# EAGLE design mainboard (EAGLE 7.6.0)
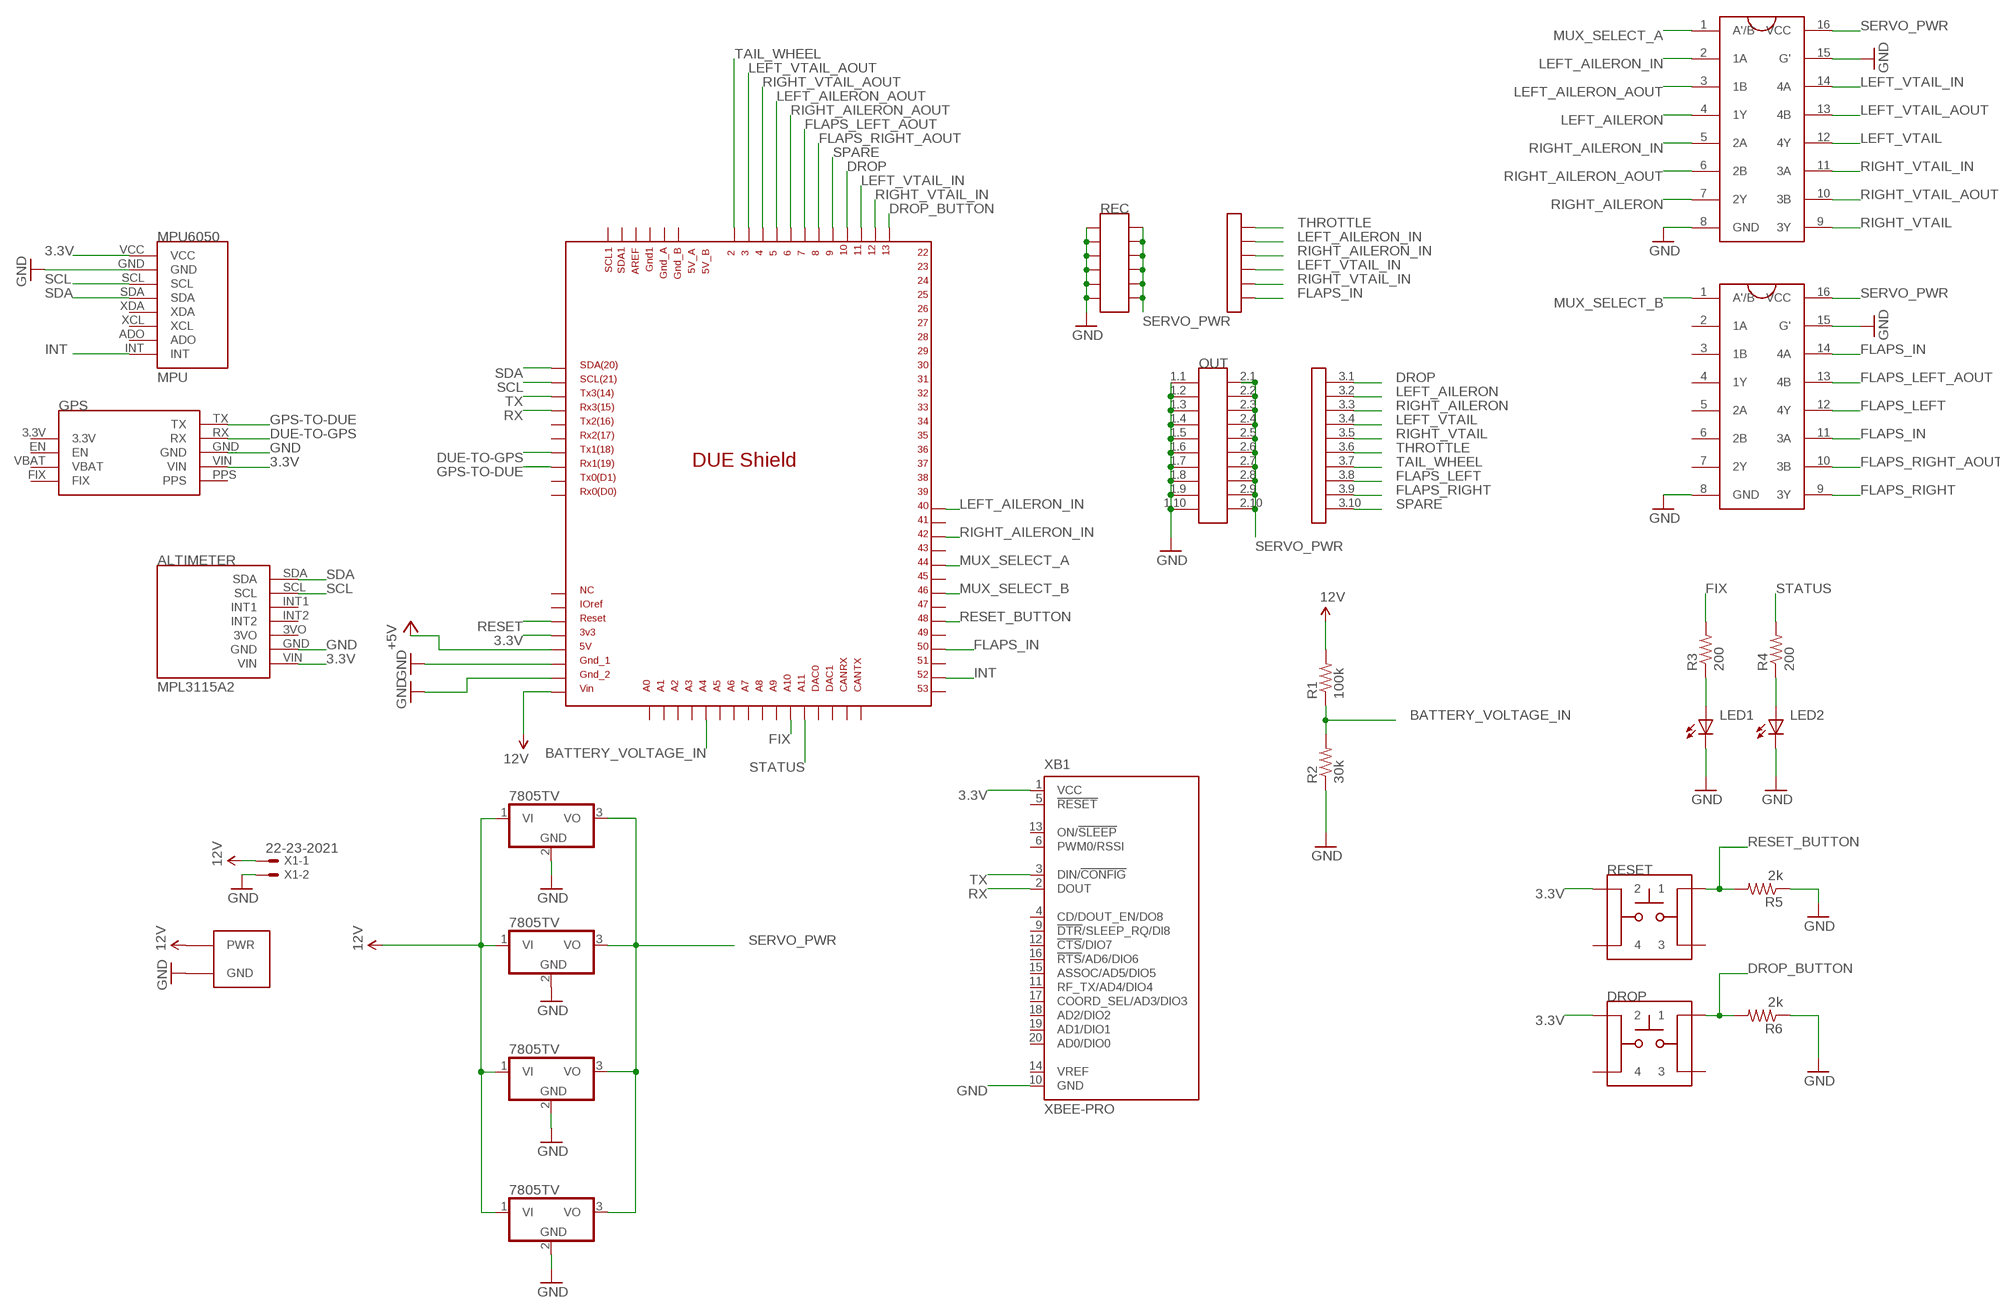
[diagram p0: schematic, sheet 1]

## Parts
DROP  PUSHBUTTON  [PUSHBUTTON]
G1  GPS_ADAFRUIT  [GPS_ADAFRUIT]
IC1  7805TV  [TO220V]
IC2  7805TV  [TO220V]
IC3  7805TV  [TO220V]
IC4  7805TV  [TO220V]
LED1  LED5MM  [LED5MM]
LED2  LED5MM  [LED5MM]
MPU  MPU6050  [MPU6050]
MUX1  SN74HC157  [SN74HC157]
MUX2  SN74HC157  [SN74HC157]
OUT  PIN_3X10  [PIN_3X10]
R1  100k  R-US_0204/7  [0204/7]
R2  30k  R-US_0204/7  [0204/7]
R3  200  R-US_0204/7  [0204/7]
R4  200  R-US_0204/7  [0204/7]
R5  2k  R-US_0204/7  [0204/7]
R6  2k  R-US_0204/7  [0204/7]
REC  PIN_3X6  [PIN_3X6]
RESET  PUSHBUTTON  [PUSHBUTTON]
U$1  DUE(NORMAL)  [DUE(NORMAL)]
U$3  PWR-BATT  [PWR-BATT]
U$4  ALTIMETER_V5  [ALTIMETER_V5]
X1  22-23-2021  [22-23-2021]
XB1  XBEE-PRO  [XBEE-PRO]

## Nets
3.3V: DROP.2 G1.VIN MPU.VCC RESET.2 U$1.3V3 U$4.VIN XB1.1(VCC)
12V: IC1.1(VI) IC2.1(VI) IC3.1(VI) IC4.1(VI) R1.2 U$1.VIN U$3.PWR X1.1
+5V: U$1.5V
BATTERY_VOLTAGE_IN: R1.1 R2.2 U$1.A4
DROP: OUT.3.1 U$1.10
DROP_BUTTON: DROP.1 R6.2 U$1.13
DUE-TO-GPS: G1.RX U$1.TX1
FIX: R3.2 U$1.A10
FLAPS_IN: MUX2.11(3A) MUX2.14(4A) REC.3.6 U$1.50
FLAPS_LEFT: MUX2.12(4Y) OUT.3.8
FLAPS_LEFT_AOUT: MUX2.13(4B) U$1.7
FLAPS_RIGHT: MUX2.9(3Y) OUT.3.9
FLAPS_RIGHT_AOUT: MUX2.10(3B) U$1.8
GND: G1.GND IC1.2(GND) IC2.2(GND) IC3.2(GND) IC4.2(GND) LED1.K(C) LED2.K(C) MPU.GND MUX1.8(GND) MUX1.15(G') MUX2.8(GND) MUX2.15(G') OUT.1.1 OUT.1.2 OUT.1.3 OUT.1.4 OUT.1.5 OUT.1.6 OUT.1.7 OUT.1.8 OUT.1.9 OUT.1.10 R2.1 R5.1 R6.1 REC.1.1 REC.1.2 REC.1.3 REC.1.4 REC.1.5 REC.1.6 U$1.GND_1 U$1.GND_2 U$3.GND U$4.GND X1.2 XB1.10(GND)
GPS-TO-DUE: G1.TX U$1.RX1
INT: MPU.INT U$1.52
LEFT_AILERON: MUX1.4(1Y) OUT.3.2
LEFT_AILERON_AOUT: MUX1.3(1B) U$1.5
LEFT_AILERON_IN: MUX1.2(1A) REC.3.2 U$1.40
LEFT_VTAIL: MUX1.12(4Y) OUT.3.4
LEFT_VTAIL_AOUT: MUX1.13(4B) U$1.3
LEFT_VTAIL_IN: MUX1.14(4A) REC.3.4 U$1.11
MUX_SELECT_A: MUX1.1(A'/B) U$1.44
MUX_SELECT_B: MUX2.1(A'/B) U$1.46
N$1: LED1.A R3.1
N$3: LED2.A R4.1
RESET: U$1.RESET
RESET_BUTTON: R5.2 RESET.1 U$1.48
RIGHT_AILERON: MUX1.7(2Y) OUT.3.3
RIGHT_AILERON_AOUT: MUX1.6(2B) U$1.6
RIGHT_AILERON_IN: MUX1.5(2A) REC.3.3 U$1.42
RIGHT_VTAIL: MUX1.9(3Y) OUT.3.5
RIGHT_VTAIL_AOUT: MUX1.10(3B) U$1.4
RIGHT_VTAIL_IN: MUX1.11(3A) REC.3.5 U$1.12
RX: U$1.RX3 XB1.2(DOUT)
SCL: MPU.SCL U$1.SCL U$4.SCL
SDA: MPU.SDA U$1.SDA U$4.SDA
SERVO_PWR: IC1.3(VO) IC2.3(VO) IC3.3(VO) IC4.3(VO) MUX1.16(VCC) MUX2.16(VCC) OUT.2.1 OUT.2.2 OUT.2.3 OUT.2.4 OUT.2.5 OUT.2.6 OUT.2.7 OUT.2.8 OUT.2.9 OUT.2.10 REC.2.1 REC.2.2 REC.2.3 REC.2.4 REC.2.5 REC.2.6
SPARE: OUT.3.10 U$1.9
STATUS: R4.2 U$1.A11
TAIL_WHEEL: OUT.3.7 U$1.2
THROTTLE: OUT.3.6 REC.3.1
TX: U$1.TX3 XB1.3(DIN/!CONFIG)
Unconnected: DROP.3 DROP.4 G1.3.3V G1.EN G1.FIX G1.PPS G1.VBAT MPU.ADO MPU.XCL MPU.XDA MUX2.2(1A) MUX2.3(1B) MUX2.4(1Y) MUX2.5(2A) MUX2.6(2B) MUX2.7(2Y) RESET.3 RESET.4 U$1.41 U$1.43 U$1.45 U$1.47 U$1.49 U$1.51 U$1.53 U$1.A0 U$1.A1 U$1.A2 U$1.A3 U$1.A5 U$1.A6 U$1.A7 U$1.A8 U$1.A9 U$1.AREF U$1.CANRX U$1.CANTX U$1.DAC0 U$1.DAC1 U$1.GND1 U$1.GND_A U$1.GND_B U$1.IOREF U$1.NC U$1.RX0 U$1.RX2 U$1.SCL1 U$1.SDA1 U$1.TX0 U$1.TX2 U$4.3VO U$4.INT1 U$4.INT2 XB1.4(CD/DOUT_EN/DO8) XB1.5(!RESET) XB1.6(PWM0/RSSI) XB1.9(!DTR!/SLEEP_RQ/DI8) XB1.11(RF_TX/AD4/DIO4) XB1.12(!CTS!/DIO7) XB1.13(ON/!SLEEP) XB1.14(VREF) XB1.15(ASSOC/AD5/DIO5) XB1.16(!RTS!/AD6/DIO6) XB1.17(COORD_SEL/AD3/DIO3) XB1.18(AD2/DIO2) XB1.19(AD1/DIO1) XB1.20(AD0/DIO0)

## Library data of the parts
DROP RESET = QADT:PUSHBUTTON: E-SWITCH KS0-01Q-01
G1 = QADT:GPS_ADAFRUIT: Adafruit GPS Footprint for Adafruit Ultimate GPS breakout board
IC1-IC4 = linear:78*: Positive VOLTAGE REGULATOR Source: http://cache.national.com/ds/LM/LM78L05.pdf http://www.fairchildsemi.com/ds/LM/LM7805.pdf
LED1 LED2 = led:LED: LED OSRAM: - CHIPLED LG R971, LG N971, LY N971, LG Q971, LY Q971, LO R971, LY R971 LH N974, LH R974 LS Q976, LO Q976, LY Q976 LO Q996 - Hyper CHIPLED LW Q18S LB Q993, LB Q99A, LB R99A - SideLED LS A670, LO A670, LY A670, LG A670, LP A670 LB A673, LV A673, LT A673, LW A673 LH A674 LY A675 LS A676, LA A676, LO A676, LY A676, LW A676 LS A679, LY A679, LG A679 - Hyper Micro SIDELED® LS Y876, LA Y876, LO Y876, LY Y876 LT Y87S - SmartLED LW L88C, LW L88S LB L89C, LB L89S, LG L890 LS L89K, LO L89K, LY L89K LS L896, LA L896, LO L896, LY L896 - TOPLED LS T670, LO T670, LY T670, LG T670, LP T670 LSG T670, LSP T670, LSY T670, LOP T670, LYG T670 LG T671, LOG T671, LSG T671 LB T673, LV T673, LT T673, LW T673 LH T674 LS T676, LA T676, LO T676, LY T676, LB T676, LH T676, LSB T676, LW T676 LB T67C, LV T67C, LT T67C, LS T67K, LO T67K, LY T67K, LW E67C LS E67B, LA E67B, LO E67B, LY E67B, LB E67C, LV E67C, LT E67C LW T67C LS T679, LY T679, LG T679 LS T770, LO T770, LY T770, LG T770, LP T770 LB T773, LV T773, LT T773, LW T773 LH T774 LS E675, LA E675, LY E675, LS T675 LS T776, LA T776, LO T776, LY T776, LB T776 LHGB T686 LT T68C, LB T68C - Hyper Mini TOPLED® LB M676 - Mini TOPLED Santana® LG M470 LS M47K, LO M47K, LY M47K Source: http://www.osram.convergy.de LUXEON: - LUMILED® LXK2-PW12-R00, LXK2-PW12-S00, LXK2-PW14-U00, LXK2-PW14-V00 LXK2-PM12-R00, LXK2-PM12-S00, LXK2-PM14-U00 LXK2-PE12-Q00, LXK2-PE12-R00, LXK2-PE12-S00, LXK2-PE14-T00, LXK2-PE14-U00 LXK2-PB12-K00, LXK2-PB12-L00, LXK2-PB12-M00, LXK2-PB14-N00, LXK2-PB14-P00, LXK2-PB14-Q00 LXK2-PR12-L00, LXK2-PR12-M00, LXK2-PR14-Q00, LXK2-PR14-R00 LXK2-PD12-Q00, LXK2-PD12-R00, LXK2-PD12-S00 LXK2-PH12-R00, LXK2-PH12-S00 LXK2-PL12-P00, LXK2-PL12-Q00, LXK2-PL12-R00 Source: www.luxeon.com KINGBRIGHT: KA-3528ASYC Source: www.kingbright.com
MPU = aero_sensors:MPU6050
MUX1 MUX2 = QADT:SN74HC157: 2-to-1 MUX TI SN74HC157
OUT = QADT:PIN_3X10
R1-R6 = rcl:R-US_: RESISTOR, American symbol
REC = DUElib130425:PIN_3X6
U$1 = DUElib130425:DUE(NORMAL)
U$3 = DUElib130425:PWR-BATT
U$4 = QADT:ALTIMETER_V5: Adafruit Altimeter MPL3115A2
X1 = con-molex:22-23-2021: .100" (2.54mm) Center Header - 2 Pin; MF: MOLEX; MPN: 22-23-2021; OC_FARNELL: 1462926; OC_NEWARK: 25C3832
XB1 = maxstream:XBEE: XBee (TM) /XBee-PRO(TM) OEM RF Modules Source: MaxStream, Inc. xbee_productmanual.pdf; MPN: XBP24-AWI-001; OC_FARNELL: 1337916; OC_NEWARK: 42M2667

## Board
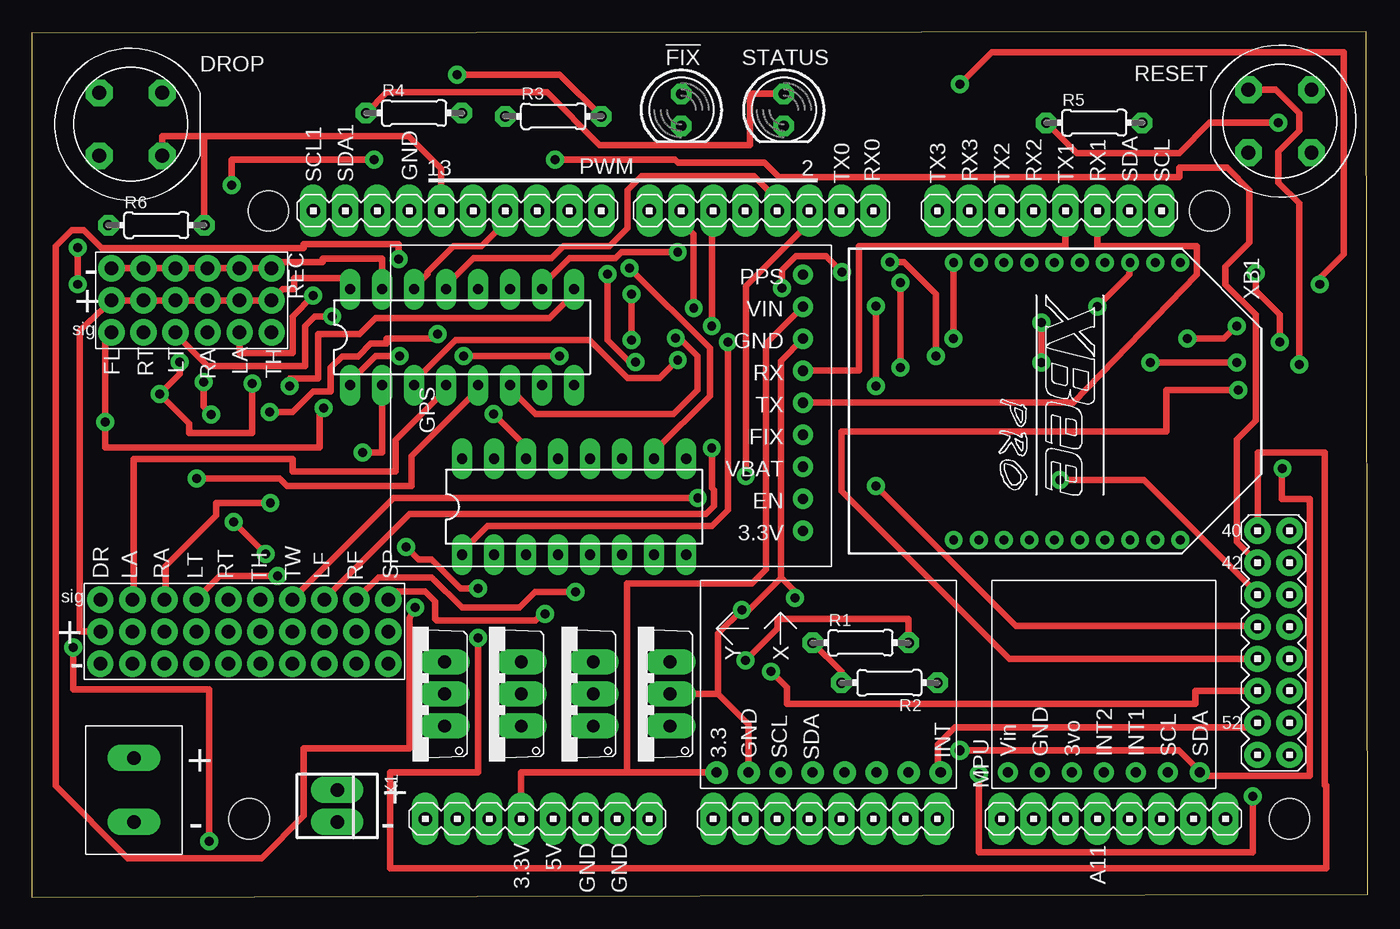
[diagram p1: board, top side]
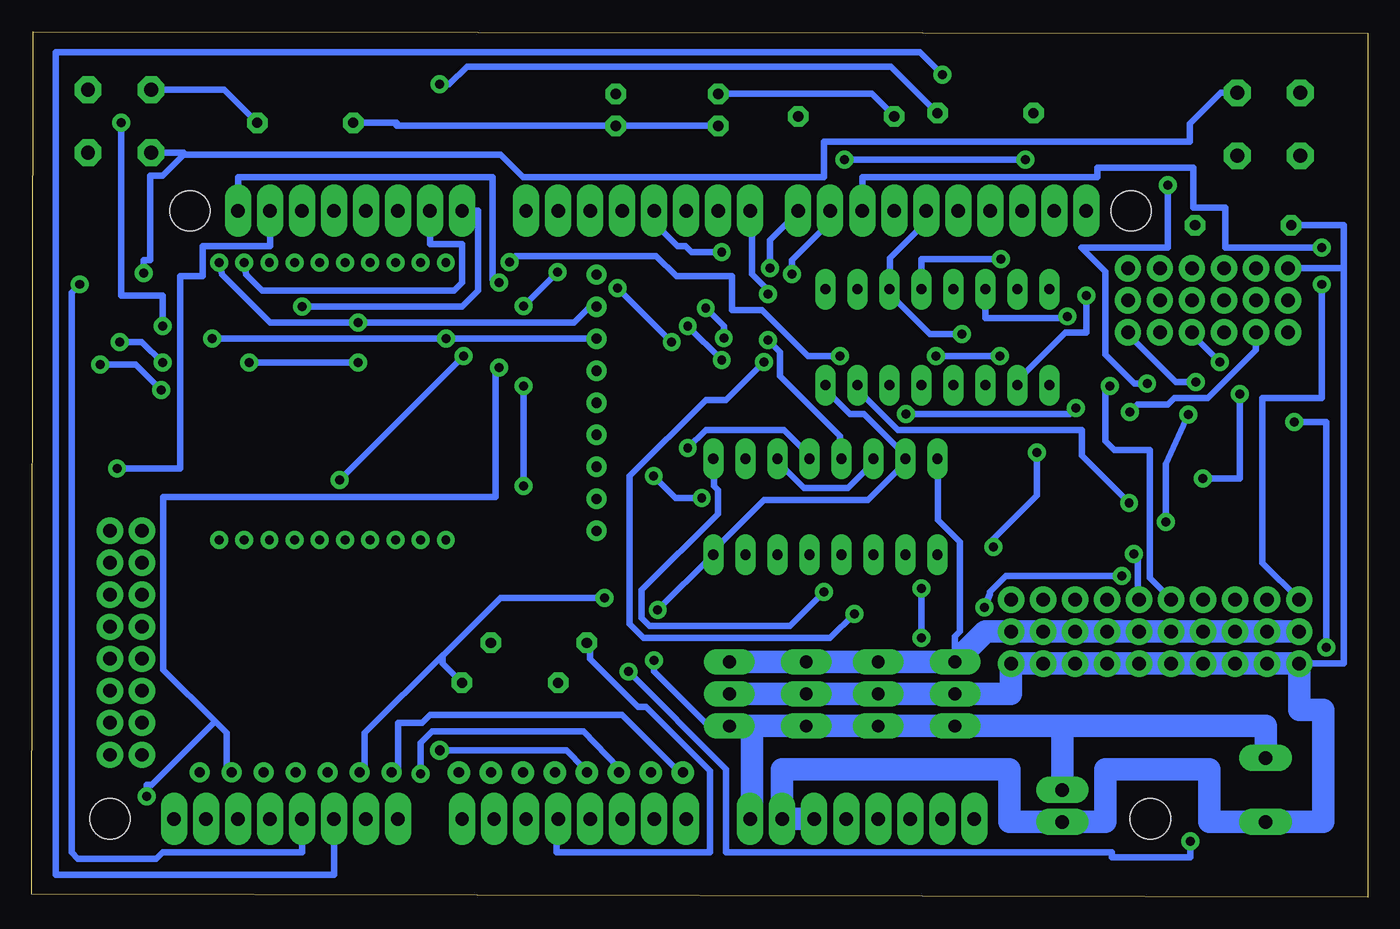
[diagram p2: board, bottom side, seen from below]

Size 106.05 x 68.71 mm. Coordinates in mm from the lower left corner, seen from the top.
Outline: 0,0 106.05,0.25 105.92,68.71 0,68.58 0,0
Copper layers (1*16): Top 0.035mm / dielectric 1.5mm / Bottom 0.035mm
Design rules "default *": minimum track width 20mil, minimum drill 28mil, track to track 16mil, track to pad 12mil, pad to pad 12mil, via to via 12mil, smd to smd 8mil, copper to edge 40mil, drill to drill 8mil, minimum pad ring 10mil, minimum via ring 8mil, stop-mask expansion 4mil, vias tented up to drill 0mil, thermal gap 10mil
Holes 3.2 mm at 18.8,54.48 99.82,6.22 93.47,54.48 17.27,6.22

### Footprints (pad centres in the part's own frame; a part is rotated, then mirrored left to right if it is on the bottom)
PUSHBUTTON = drill 1.1 octagon: 1 2.5,2.5; 2 -2.5,2.5; 3 2.5,-2.5; 4 -2.5,-2.5
GPS_ADAFRUIT = drill 0.8: 3.3V -15.24,10.16; EN -15.24,7.62; FIX -15.24,2.54; GND -15.24,-5.08; PPS -15.24,-10.16; RX -15.24,-2.54; TX -15.24,0; VBAT -15.24,5.08; VIN -15.24,-7.62
TO220V = drill 1.016 long: 1 -2.54,-2.54; 2 0,-2.54; 3 2.54,-2.54
LED5MM = drill 0.813 octagon: A -1.27,0; K 1.27,0
MPU6050 = drill 0.8 pad 1.778: ADO -13.97,-3.81; GND -13.97,8.89; INT -13.97,-6.35; SCL -13.97,6.35; SDA -13.97,3.81; VCC -13.97,11.43; XCL -13.97,-1.27; XDA -13.97,1.27
SN74HC157 = drill 0.813 long: 1 -8.89,-3.81; 2 -6.35,-3.81; 3 -3.81,-3.81; 4 -1.27,-3.81; 5 1.27,-3.81; 6 3.81,-3.81; 7 6.35,-3.81; 8 8.89,-3.81; 9 8.89,3.81; 10 6.35,3.81; 11 3.81,3.81; 12 1.27,3.81; 13 -1.27,3.81; 14 -3.81,3.81; 15 -6.35,3.81; 16 -8.89,3.81
PIN_3X10 = drill 1.067: 1.1 0,7.62; 1.2 0,5.08; 1.3 0,2.54; 1.4 0,0; 1.5 0,-2.54; 1.6 0,-5.08; 1.7 0,-7.62; 1.8 0,-10.16; 1.9 0,-12.7; 1.10 0,-15.24; 2.1 2.54,7.62; 2.2 2.54,5.08; 2.3 2.54,2.54; 2.4 2.54,0; 2.5 2.54,-2.54; 2.6 2.54,-5.08; 2.7 2.54,-7.62; 2.8 2.54,-10.16; 2.9 2.54,-12.7; 2.10 2.54,-15.24; 3.1 5.08,7.62; 3.2 5.08,5.08; 3.3 5.08,2.54; 3.4 5.08,0; 3.5 5.08,-2.54; 3.6 5.08,-5.08; 3.7 5.08,-7.62; 3.8 5.08,-10.16; 3.9 5.08,-12.7; 3.10 5.08,-15.24
0204/7 = drill 0.813 octagon: 1 -3.81,0; 2 3.81,0
PIN_3X6 = drill 1.067: 1.1 0,5.08; 1.2 0,2.54; 1.3 0,0; 1.4 0,-2.54; 1.5 0,-5.08; 1.6 0,-7.62; 2.1 2.54,5.08; 2.2 2.54,2.54; 2.3 2.54,0; 2.4 2.54,-2.54; 2.5 2.54,-5.08; 2.6 2.54,-7.62; 3.1 5.08,5.08; 3.2 5.08,2.54; 3.3 5.08,0; 3.4 5.08,-2.54; 3.5 5.08,-5.08; 3.6 5.08,-7.62
DUE(NORMAL) = drill 1.067 long: 2 -16.51,30.48; 3 -19.05,30.48; 3V3 -39.37,-17.78; 4 -21.59,30.48; 5 -24.13,30.48; 5V -36.83,-17.78; 6 -26.67,30.48; 7 -29.21,30.48; 8 -33.02,30.48; 9 -35.56,30.48; 10 -38.1,30.48; 11 -40.64,30.48; 12 -43.18,30.48; 13 -45.72,30.48; A0 -24.13,-17.78; A1 -21.59,-17.78; A2 -19.05,-17.78; A3 -16.51,-17.78; A4 -13.97,-17.78; A5 -11.43,-17.78; A6 -8.89,-17.78; A7 -6.35,-17.78; A8 -1.27,-17.78; A9 1.27,-17.78; A10 3.81,-17.78; A11 6.35,-17.78; AREF -50.8,30.48; CANRX 13.97,-17.78; CANTX 16.51,-17.78; DAC0 8.89,-17.78; DAC1 11.43,-17.78; GND1 -48.26,30.48; GND_1 -34.29,-17.78; GND_2 -31.75,-17.78; IOREF -44.45,-17.78; NC -46.99,-17.78; RESET -41.91,-17.78; RX0 -11.43,30.48; RX1 6.35,30.48; RX2 1.27,30.48; RX3 -3.81,30.48; SCL 11.43,30.48; SCL1 -55.88,30.48; SDA 8.89,30.48; SDA1 -53.34,30.48; TX0 -13.97,30.48; TX1 3.81,30.48; TX2 -1.27,30.48; TX3 -6.35,30.48; VIN -29.21,-17.78 | drill 1.067: 40 19.05,5.08; 41 21.59,5.08; 42 19.05,2.54; 43 21.59,2.54; 44 19.05,0; 45 21.59,0; 46 19.05,-2.54; 47 21.59,-2.54; 48 19.05,-5.08; 49 21.59,-5.08; 50 19.05,-7.62; 51 21.59,-7.62; 52 19.05,-10.16; 53 21.59,-10.16; GND_A 19.05,-12.7; GND_B 21.59,-12.7
PWR-BATT = drill 1.067 long: GND 0,0; PWR 0,5.08
ALTIMETER_V5 = drill 0.8: 3VO 0,-5.08; GND 0,-7.62; INT1 0,0; INT2 0,-2.54; SCL 0,2.54; SDA 0,5.08; VIN 0,-10.16
22-23-2021 = drill 1.067 long: 1 -1.27,0; 2 1.27,0
XBEE-PRO = drill 0.711: 1 -11,9; 2 -11,7; 3 -11,5; 4 -11,3; 5 -11,1; 6 -11,-1; 7 -11,-3; 8 -11,-5; 9 -11,-7; 10 -11,-9; 11 11,-9; 12 11,-7; 13 11,-5; 14 11,-3; 15 11,-1; 16 11,1; 17 11,3; 18 11,5; 19 11,7; 20 11,9

### Placement (x,y rotation side)
DROP  7.87,61.34 270 top
G1  45.97,39.24 180 top
IC1  30.23,16.13 90 top
IC2  36.32,16.13 90 top
IC3  42.04,16.13 90 top
IC4  48.13,16.13 90 top
LED1  51.56,62.48 270 top
LED2  59.69,62.48 270 top
MPU  65.79,23.88 90 top
MUX1  34.16,44.45 0 top
MUX2  43.05,30.99 0 top
OUT  13.08,18.54 90 top
R1  65.79,20.19 0 top
R2  68.07,17.02 180 top
R3  41.4,61.98 0 top
R4  30.35,62.23 0 top
R5  84.33,61.47 0 top
R6  9.91,53.34 0 top
REC  13.97,49.91 270 top
RESET  99.06,61.6 90 top
U$1  78.23,24 0 top
U$3  8.13,5.97 0 top
U$4  87.63,9.91 270 top
X1  24.26,7.24 270 top
XB1  82.17,39.37 270 top

### Tracks (layer width: path | path; a pad name or v marks a point on that pad's centre or on a via)
3.3V  (via drill 0.71)
  Top 0.508: MPU.VCC 47.24,9.91 | 47.24,9.91 47.24,24.89 57.15,24.89 58.29,26.04 58.29,43.94 G1.VIN | U$1.3V3 38.86,9.91 47.24,9.91 | v97.16,49.53 97.16,48.13 99.06,46.23 v99.06,44.07 | v95.63,42.42 v88.77,42.42 | v80.14,42.42 v80.14,45.59
  Bottom 0.508: XB1.1 90.93,49.4 87.12,45.59 v80.14,45.59 62.99,45.59 61.72,46.86 G1.VIN | U$4.VIN 76.96,10.03 76.96,13.84 75.06,13.84 74.42,14.48 59.18,14.48 54.74,10.03 MPU.VCC | RESET.2 93.98,59.1 93.98,58.93 | DROP.2 11.68,63.84 14.14,61.38 14.14,59.94 43.18,59.94 43.18,57.15 67.06,57.15 68.83,58.93 93.98,58.93 | v99.06,44.07 97.28,44.07 v95.63,42.42 | v88.77,42.42 v80.14,42.42 | v97.16,49.53 97.16,50.55 96.65,50.55 96.65,57.28 95.63,57.28 93.98,58.93
12V  (via drill 0.71)
  Top 0.508: R1.2 69.6,22.1 59.18,22.1 59.18,21.34 v56.64,18.8
  Bottom 0.508: IC4.1 52.32,13.59 56.64,17.91 v56.64,18.8
  Bottom 1.778: 24.26,13.59 IC1.1 IC2.1 IC3.1 48.9,13.59 | 8.13,10.92 U$3.PWR 8.13,13.59 24.26,13.59 | X1.1 24.26,13.59 | 48.9,13.59 IC4.1 | U$1.VIN 48.9,6.22 48.9,13.59
BATTERY_VOLTAGE_IN
  Top 0.508: R2.2 64.26,17.91 R1.1
  Bottom 0.508: R1.1 61.72,20.19 61.72,18.92 57.91,15.11 57.28,15.11 52.2,10.03 52.2,3.56 64.39,3.56 64.39,6.22 U$1.A4
DROP  (via drill 0.71)
  Top 0.508: v3.68,51.56 v3.68,48.64
  Bottom 0.508: v3.68,51.56 11.3,51.56 11.3,54.74 13.84,54.74 13.84,57.91 21.46,57.91 21.46,57.15 40.13,57.15 U$1.10 | v3.68,48.64 3.68,39.62 8.38,39.62 8.38,26.54 OUT.3.1
DROP_BUTTON
  Top 0.508: 13.72,60.41 29.93,60.41 32.51,57.83 U$1.13 | R6.2 13.72,60.41 | 13.72,60.41 10.37,60.41 DROP.1
DUE-TO-GPS
  Top 0.508: G1.RX 65.66,41.78 65.66,51.69 82.04,51.69 U$1.TX1
FIX  (via drill 0.71)
  Top 0.508: v33.78,65.28 41.91,65.28 R3.2
  Bottom 0.508: U$1.A10 82.04,1.78 104.14,1.78 104.14,67.06 35.56,67.06 v33.78,65.28
FLAPS_IN  (via drill 0.71)
  Top 0.508: v58.67,17.91 59.94,16.64 59.94,15.37 92.33,15.37 92.33,16.38 U$1.50 | v14.1,4.44 14.1,16.51 3.3,16.51 v3.3,19.81 | REC.3.6 5.84,44.83 v5.84,37.72 5.84,35.69 22.86,35.69 22.86,38.51 v23.18,38.83 | v36.67,38.35 39.21,35.81 39.21,34.86 MUX2.14
  Bottom 0.508: v58.67,17.91 50.93,10.16 50.93,3.56 20.32,3.56 20.32,3.17 14.1,3.17 v14.1,4.44 | v3.3,19.81 3.3,37.72 v5.84,37.72 | MUX2.14 39.37,34.7 39.37,34.39 41.27,32.48 44.77,32.48 46.99,34.7 MUX2.11 | v36.67,38.35 23.65,38.35 v23.18,38.83
FLAPS_LEFT  (via drill 0.71)
  Top 0.508: v53.98,35.66 53.98,32.48 54.13,32.32 54.13,31.05 53.5,30.42 30,30.42 23.34,23.75 OUT.3.8
  Bottom 0.508: v53.98,35.66 52.55,37.08 46.35,37.08 44.45,35.18 44.45,34.86 MUX2.12
FLAPS_LEFT_AOUT  (via drill 0.71)
  Top 0.508: v47.62,47.88 v47.62,44.23
  Bottom 0.508: v47.62,44.23 46.67,43.28 46.67,41.37 41.91,36.61 41.91,34.86 MUX2.13 | v47.62,47.88 47.62,48.2 48.9,49.47 48.9,54.39 U$1.7
FLAPS_RIGHT  (via drill 0.71)
  Top 0.508: OUT.3.9 25.88,23.75 27.53,25.4 31.75,25.4 34.16,22.99 38.73,22.99 39.97,24.22 v43.18,24.22
  Bottom 0.508: v43.18,24.22 45.88,21.53 56.99,21.53 57.63,22.16 57.63,24.38 51.59,30.42 51.59,32.32 51.91,32.64 51.91,34.7 MUX2.9
FLAPS_RIGHT_AOUT  (via drill 0.71)
  Top 0.508: v47.47,49.94 53.82,43.59 53.82,39.78 49.53,35.5 49.53,34.86 MUX2.10
  Bottom 0.508: v47.47,49.94 47.47,52.16 45.24,54.39 U$1.8
GND  (via drill 0.71)
  Top 0.508: 56.74,10.29 MPU.GND 56.9,13.72 54.48,16.13 | REC.1.6 REC.1.5 REC.1.4 REC.1.3 REC.1.2 REC.1.1 19.56,50.42 23.11,50.42 23.11,50.67 27.81,50.67 MUX1.15 | 59.46,25.4 59.46,25.35 56.63,22.52 v56.36,22.8 54.48,20.92 54.48,16.13 | 59.46,25.4 59.46,42.57 G1.GND | v73.15,44.32 73.15,49.4 XB1.10 | v60.58,23.75 60.58,24.28 59.46,25.4 | IC4.2 54.48,16.13 | v91.69,44.32 94.61,44.32 v95.63,45.34 | R5.1 82.93,59.05 91.06,59.05 93.47,61.47 v98.93,61.47
  Bottom 0.508: 73.43,19.2 79.6,13.03 79.6,10.29 U$4.GND | REC.1.6 1.91,49.91 | 1.91,49.91 1.91,18.54 OUT.1.1 | R2.1 73.43,18.57 73.43,19.2 | 73.43,19.2 73.38,19.2 68.83,23.75 v60.58,23.75 | G1.GND v73.15,44.32 v91.69,44.32 | MUX1.8 43.02,40.58 43.02,40.26 41.12,38.35 40.01,38.35 36.83,35.18 36.83,34.86 MUX2.15 36.67,34.54 39.69,31.53 47.94,31.53 51.91,27.56 51.91,27.24 MUX2.8 52.07,27.08 v56.36,22.8 | 1.91,49.91 1.91,53.34 R6.1 | v95.63,45.34 95.63,47.75 98.93,47.75 v98.93,61.47 | LED1.K LED2.K 77.09,61.21 77.09,61.47 R5.1
  Bottom 1.778: IC4.2 IC3.2 IC2.2 IC1.2 28.32,16.13 OUT.1.10 OUT.1.9 OUT.1.8 OUT.1.7 OUT.1.6 OUT.1.5 OUT.1.4 OUT.1.3 OUT.1.2 OUT.1.1 5.46,14.86 3.56,14.86 3.56,5.97 U$3.GND 12.57,5.97 12.57,10.16 20.83,10.16 20.83,5.97 X1.2 28.45,5.97 28.45,10.16 46.48,10.16 U$1.GND_2 U$1.GND_1
GPS-TO-DUE
  Top 0.508: G1.TX 82.68,39.24 92.46,49.4 92.46,51.69 84.58,51.69 U$1.RX1
INT
  Top 0.508: MPU.INT 71.91,10.29 71.91,12.12 73.28,13.49 96.98,13.49 U$1.52
LEFT_AILERON
  Top 0.508: MUX1.4 32.86,40.58 32.86,40.26 28.89,36.29 28.89,33.78 20.7,33.78 20.7,34.77 8.1,34.77 8.1,23.75 OUT.3.2
LEFT_AILERON_AOUT  (via drill 0.71)
  Top 0.508: v51.28,42.64 49.85,41.21 47.31,41.21 44.29,44.23 33.66,44.23 30.48,41.05 30.48,40.73 MUX1.3 | v53.98,45.34 53.98,54.39 U$1.5
  Bottom 0.508: v53.98,45.34 v51.28,42.64
LEFT_AILERON_IN  (via drill 0.71)
  Top 0.508: 16.51,44.7 REC.3.2 16.51,43.18 20.7,43.18 20.7,46.1 v22.35,47.75 | U$1.40 97.28,35.31 102.62,35.31 102.62,8.89 102.74,8.89 102.74,2.29 28.45,2.29 28.45,9.91 35.43,9.91 v35.43,20.57 | v35.43,24.51 34.04,24.51 31.75,26.8 30.73,26.8 v29.72,27.81 | v26.29,35.31 27.81,35.31 MUX1.2
  Bottom 0.508: MUX1.2 27.78,40.73 27.78,41.05 24,44.83 22.35,44.83 v22.35,47.75 | v35.43,20.57 v35.43,24.51 | v29.72,27.81 29.72,28.45 26.29,31.88 v26.29,35.31
LEFT_VTAIL  (via drill 0.71)
  Top 0.508: v30.45,22.99 30,22.16 30,11.81 21.59,11.81 21.59,6.44 18.26,3.11 7.62,3.11 1.91,8.83 1.91,51.69 3.17,52.96 4.13,52.96 5.56,51.53 21.59,51.53 21.59,51.82 29.11,51.82 v29.11,50.64 | v19.53,25.49 14.92,25.49 13.18,23.75 OUT.3.4
  Bottom 0.508: v30.45,22.99 30,24.07 30,24.22 28.73,25.49 v19.53,25.49 | MUX1.12 35.43,50.64 v29.11,50.64
LEFT_VTAIL_AOUT
  Top 0.508: MUX1.13 33.02,48.36 33.02,48.67 35.08,50.74 41.27,50.74 42.23,51.69 45.88,51.69 47.31,53.12 47.31,56.13 48.42,57.25 57.31,57.25 59.05,55.5 59.05,54.55 U$1.3
LEFT_VTAIL_IN  (via drill 0.71)
  Top 0.508: 30.32,48.36 MUX1.14 30.48,48.51 31.43,49.47 31.43,49.62 33.5,51.69 35.72,51.69 37.47,53.44 37.47,54.39 U$1.11 | 23.5,46.1 v23.84,46.1 22.48,46.1 21.72,45.34 21.72,42.16 13.97,42.16 11.43,44.7 REC.3.4
  Bottom 0.508: MUX1.14 30.35,45.97 23.97,45.97 v23.84,46.1
MUX_SELECT_A  (via drill 0.71)
  Top 0.508: v29.21,42.96 27.3,42.96 25.4,41.05 25.4,40.73 MUX1.1 | v41.91,42.96 v34.29,42.96 | v68.1,50.42 69.22,50.42 71.75,47.88 v71.75,42.96 | v81.6,33.12 88.27,33.12 97.31,24.07 U$1.44
  Bottom 0.508: v34.29,42.96 v29.21,42.96 | v41.91,42.96 44.45,42.96 48.1,46.61 50.48,46.61 50.48,49.28 54.86,49.28 56.48,50.9 67.63,50.9 v68.1,50.42 | v81.6,33.12 v71.75,42.96
MUX_SELECT_B  (via drill 0.71)
  Top 0.508: v55.24,44.07 55.24,30.73 53.98,29.46 36.2,29.46 34.29,27.56 34.29,27.24 MUX2.1 | v59.53,48.36 59.53,49.78 60.64,50.9 63.02,50.9 v64.29,49.62 | v66.99,40.58 v66.99,46.93 | v66.99,32.64 78.11,21.53 97.16,21.53 U$1.46
  Bottom 0.508: v59.53,48.36 v55.24,44.07 | v66.99,46.93 v64.29,49.62 | v66.99,32.64 v66.99,40.58
N$1
  Bottom 0.508: LED1.A 39.37,63.75 R3.1
N$3
  Top 0.508: R4.1 28.19,63.88 40.89,63.88 45.09,59.69 57.02,59.69 57.02,63.75 LED2.A
RESET_BUTTON  (via drill 0.71)
  Top 0.508: U$1.48 77.6,18.92 64.26,32.26 64.26,36.96 90.04,36.96 90.04,40.26 v95.76,40.26 | v100.58,42.29 100.58,55.07 98.93,56.72 98.93,59.18 100.58,60.83 100.58,62.23 98.72,64.09 RESET.1
  Bottom 0.508: v95.76,40.26 97.79,42.29 v100.58,42.29 | RESET.1 90.77,64.09 R5.2
RIGHT_AILERON  (via drill 0.71)
  Top 0.508: v18.95,31.3 14.64,31.3 14.64,30.29 10.64,26.29 10.64,23.75 OUT.3.3
  Bottom 0.508: MUX1.7 40.48,40.58 40.48,40.26 37.31,37.08 22.7,37.08 22.7,35.05 v18.95,31.3
RIGHT_AILERON_AOUT  (via drill 0.71)
  Top 0.508: v51.12,44.39 51.44,44.39 52.86,42.96 52.86,40.26 50.96,38.35 40.01,38.35 38.1,40.26 38.1,40.58 MUX1.6 | v52.55,46.77 52.55,52.64 51.59,53.59 51.59,54.39 U$1.6
  Bottom 0.508: v51.12,44.39 51.12,45.34 v52.55,46.77
RIGHT_AILERON_IN  (via drill 0.71)
  Top 0.508: v11.75,42.48 11.75,41.53 v10.16,39.94 12.51,37.59 12.51,36.83 17.53,36.83 v17.53,40.77 | MUX1.5 35.4,40.58 35.4,40.26 30.16,35.02 30.16,32.64 20.29,32.64 19.68,33.24 v13.11,33.24 | v15.88,56.52 15.88,58.55 v27.18,58.55 | U$1.42 95.63,28.19 95.63,36.32 97.16,37.85 97.16,46.23 94.74,48.64 94.74,50.04 96.65,51.94 96.65,56.13 94.87,57.91 91.06,57.91 91.06,57.15 59.31,57.15 58.17,58.29 51.31,58.29 51.05,58.55 v41.53,58.55
  Bottom 0.508: v11.75,42.48 13.97,44.7 REC.3.3 | v15.88,56.52 15.88,51.56 22.73,51.56 20.83,49.66 20.83,43.05 18.54,40.77 v17.53,40.77 | v10.16,39.94 10.16,33.24 v13.11,33.24 | v27.18,58.55 v41.53,58.55
RIGHT_VTAIL  (via drill 0.71)
  Top 0.508: MUX1.9 43.02,48.2 43.02,47.88 41.12,45.97 27.3,45.97 26.04,44.7 22.73,44.7 22.73,41.15 20.48,41.15 v20.48,40.58
  Bottom 0.508: OUT.3.5 15.72,23.75 17.3,25.34 17.3,35.5 20.13,35.5 20.83,36.2 20.83,40.23 v20.48,40.58
RIGHT_VTAIL_AOUT  (via drill 0.71)
  Top 0.508: v51.28,51.21 46.83,51.21 46.35,50.74 42.7,50.74 40.64,48.67 40.64,48.36 MUX1.10
  Bottom 0.508: v51.28,51.21 53.66,51.21 54.13,51.69 54.77,51.69 56.52,53.44 56.52,54.39 U$1.4
RIGHT_VTAIL_IN  (via drill 0.71)
  Top 0.508: v32.23,44.7 31.84,44.32 28.19,44.32 28.19,43.94 26.92,43.94 25.91,42.93 24.64,42.93 23.75,42.04 23.75,40.13 22.35,40.13 20.73,38.51 v18.89,38.51
  Bottom 0.508: U$1.12 35.08,54.39 35.08,53.59 37.94,50.74 37.94,48.36 MUX1.11 38.1,48.04 34.77,44.7 v32.23,44.7 | REC.3.5 8.89,43.43 12.7,39.62 15.37,39.62 15.88,39.12 18.29,39.12 v18.89,38.51
RX
  Bottom 0.508: XB1.2 89.03,49.4 87.76,48.13 72.52,48.13 71.88,48.77 71.88,51.82 74.42,51.82 U$1.RX3
SCL  (via drill 0.71)
  Top 0.508: v68.96,42.04 v68.96,48.77 | v96.9,8 96.9,3.56 75.18,3.56 v75.18,9.78
  Bottom 0.508: 91.49,13.95 95.61,18.06 95.61,31.75 69.22,31.75 69.22,41.78 v68.96,42.04 | 91.49,13.95 90.58,13.03 90.58,10.29 U$4.SCL | 91.49,13.95 96.52,8.92 96.9,8.92 v96.9,8 | MPU.SCL 59.49,10.29 62.23,13.16 74.24,13.16 75.16,12.24 75.18,12.24 v75.18,9.78 | v68.96,48.77 69.47,49.02 69.47,57.15 89.66,57.15 U$1.SCL
SDA  (via drill 0.71, 0.76)
  Top 0.508: v73.66,11.66 91.03,11.66 92.41,10.29 U$4.SDA | 92.73,9.83 U$4.SDA | v99.26,34.01 99.19,34.01 99.19,31.62 101.42,31.62 101.42,9.63 92.71,9.63 U$4.SDA
  Bottom 0.508: v73.66,11.66 63.6,11.66 62.23,10.29 MPU.SDA | U$1.SDA 87.12,51.69 92.46,51.69 92.46,49.28 94.23,49.28 94.23,34.01 v99.26,34.01
SERVO_PWR
  Top 0.508: OUT.2.1 3.81,21.08 3.81,44.96 REC.2.6 REC.2.5 REC.2.4 REC.2.3 REC.2.2 REC.2.1 19.94,48.26 20.83,48.26 20.83,49.15 25.27,49.15 MUX1.16
  Bottom 0.508: MUX2.16 34.13,34.7 34.13,29.94 32.38,28.19 32.38,21.08 32.77,20.7 IC1.3
  Bottom 1.778: OUT.2.1 OUT.2.2 OUT.2.3 OUT.2.4 OUT.2.5 OUT.2.6 OUT.2.7 OUT.2.8 OUT.2.9 OUT.2.10 30.35,21.08 IC1.3 IC2.3 IC3.3 IC4.3
SPARE  (via drill 0.71)
  Top 0.508: v47.94,42.48 47.47,42.48 45.72,44.23 v45.72,49.47 | OUT.3.10 28.42,23.75 28.42,24.38 28.54,24.26 31.24,24.26 32,23.49 32,22.1 32.13,21.97 40.01,21.97 40.51,22.48 v40.73,22.48
  Bottom 0.508: v47.94,42.48 50.96,39.47 52.55,39.47 58.58,33.43 58.58,21.68 57.47,20.57 42.67,20.57 40.77,22.48 v40.73,22.48 | v45.72,49.47 45.72,50.58 42.7,53.59 42.7,54.39 U$1.9
STATUS  (via drill 0.71)
  Top 0.508: v73.66,64.52 76.2,67.06 104.14,67.06 104.14,51.05 102.23,49.15 v102.23,48.64
  Bottom 0.508: U$1.A11 84.58,3.56 95.63,3.56 96.14,3.05 102.36,3.05 102.87,3.56 102.87,48.01 v102.23,48.64 | R4.2 37.85,65.91 71.5,65.91 72.9,64.52 v73.66,64.52
TAIL_WHEEL  (via drill 0.71)
  Top 0.508: v52.86,31.69 28.73,31.69 20.8,23.75 OUT.3.7 | v56.67,33.43 56.67,48.51 61.59,53.44 61.59,54.39 U$1.2
  Bottom 0.508: v52.86,31.69 54.93,31.69 v56.67,33.43
THROTTLE  (via drill 0.71)
  Top 0.508: v16.03,29.78 v18.57,27.24 | v13.65,40.89 13.65,38.93 v14.26,38.32
  Bottom 0.508: v18.57,27.24 18.26,26.92 18.26,23.75 OUT.3.6 | v16.03,29.78 16.03,34.39 v14.26,38.32 | v13.65,40.89 15.24,40.89 19.05,44.7 REC.3.1
TX  (via drill 0.71)
  Top 0.508: v84.58,46.86 87.12,49.4 XB1.3
  Bottom 0.508: v84.58,46.86 71.88,46.86 70.61,48.13 70.61,54.48 U$1.TX3

### Text on the board
tPlace: !FIX | STATUS | RESET | DROP | SCL1 | SDA1 | GND | 13 | PWM | 2 | TX0 | RX0 | TX3 | RX3 | TX2 | RX2 | TX1 | RX1 | SDA | SCL | - | + | sig | RT | LT | LA | FL | RA | TH | 40 | 42 | DR | LA | RA | LT | RT | TH | TW | LF | RF | SP | sig | + | - | 52 | 3.3 | GND | SCL | SDA | INT | + | + | - | - | 3.3V | 5V | GND | GND | A11